# EasyEDA schematic SCH_STM32小车车V3.3.0_2023-02-14.json
TITLE: Sheet_1; REV: V3.3.0; Date: 2021-11-21; Sheet: 1/1; Drawn By: 好家伙VCC; Company: 好家伙VCC
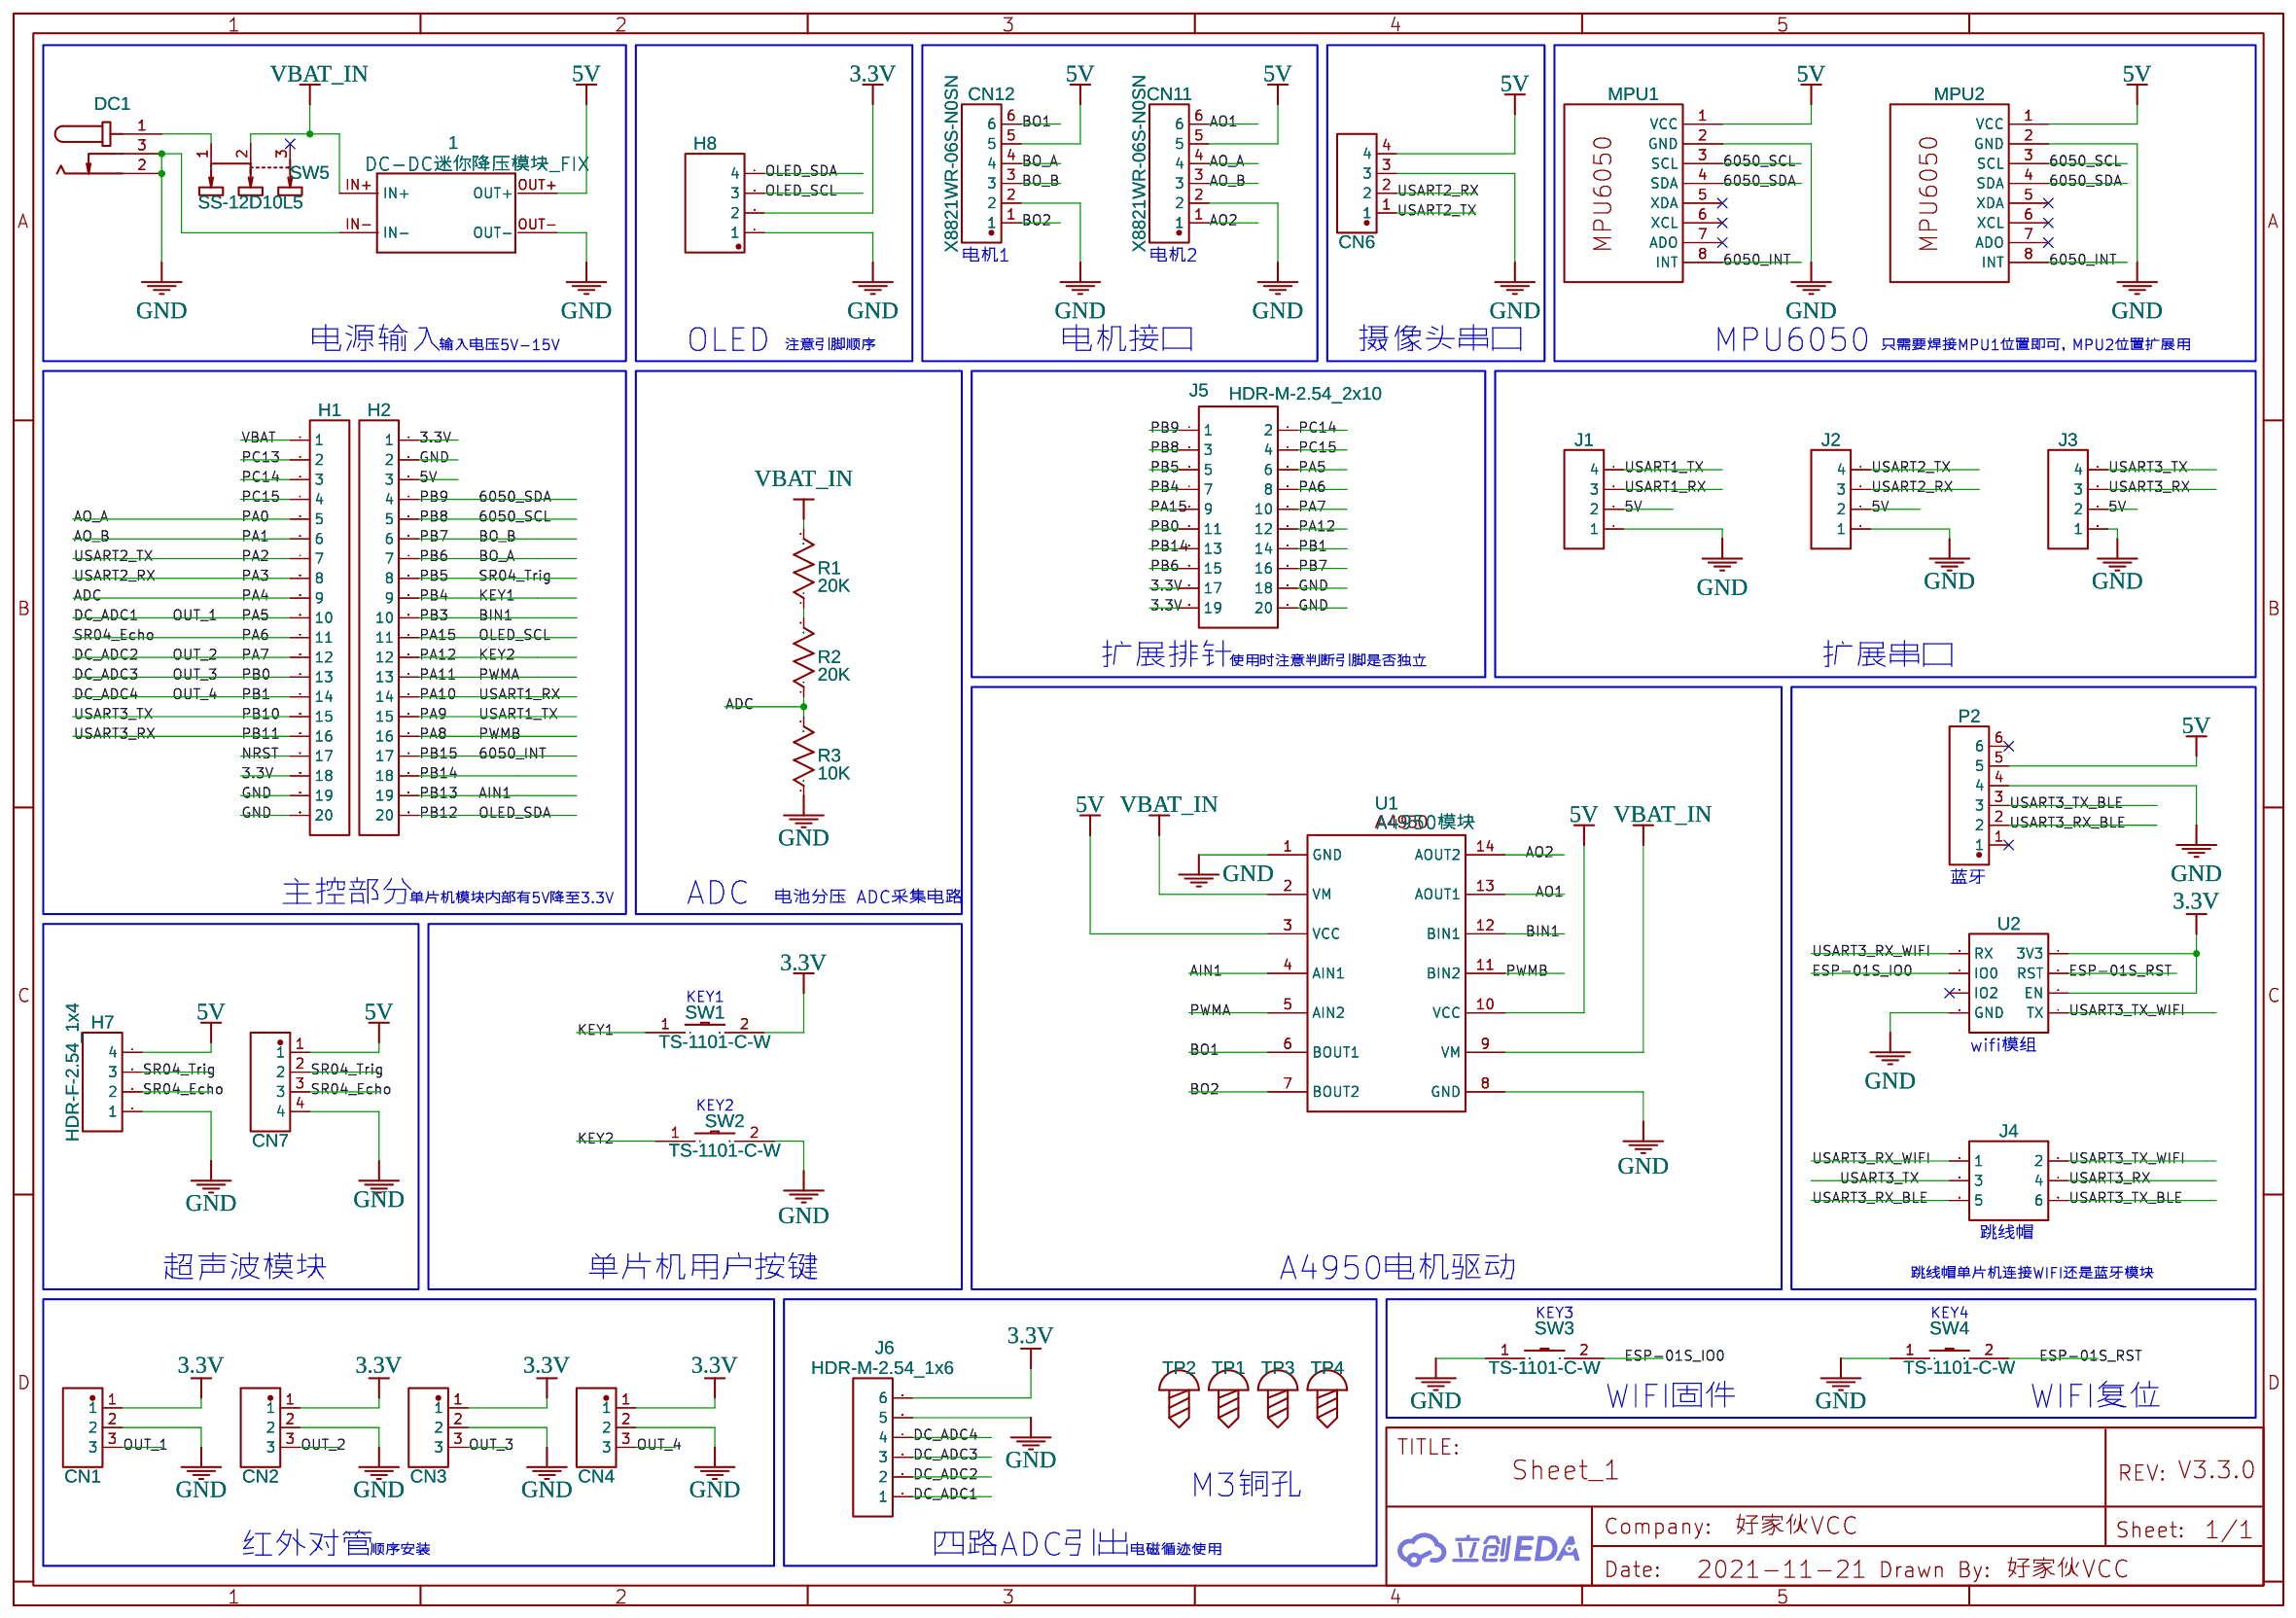
[diagram p0: schematic sheet]

## Parts
1  DC-DC迷你降压模块_FIX  [DC-DC迷你降压模块]
CN1  X8821WR-03S-N0SN  [CONN-TH_3P-P2.50_X8821WR-03S-N0SN]
CN2  X8821WR-03S-N0SN  [CONN-TH_3P-P2.50_X8821WR-03S-N0SN]
CN3  X8821WR-03S-N0SN  [CONN-TH_3P-P2.50_X8821WR-03S-N0SN]
CN4  X8821WR-03S-N0SN  [CONN-TH_3P-P2.50_X8821WR-03S-N0SN]
CN6  HX25003-4WAP  [CONN-TH_4P-P2.50_HX25003-4WAP]
CN7  HX25003-4WAP  [CONN-TH_4P-P2.50_HX25003-4WAP]
CN11  X8821WR-06S-N0SN  [CONN-TH_6P-P2.50_X8821WR-06S-N2SN]
CN12  X8821WR-06S-N0SN  [CONN-TH_6P-P2.50_X8821WR-06S-N2SN]
DC1  DC005_C431533  [DC-IN-TH_DC005]
H1  HDR-F-2.54_1x20  [HDR-F-2.54_1X20]
H2  HDR-F-2.54_1x20  [HDR-F-2.54_1X20]
H7  HDR-F-2.54_1x4  [HDR-F-2.54_1X4]
H8  Header-Male-2.54_1x4  [OLED 0.96 带铜孔]
J1  HDR-M-2.54_1x4  [HDR-M-2.54_1X4]
J2  HDR-M-2.54_1x4  [HDR-M-2.54_1X4]
J3  HDR-M-2.54_1x4  [HDR-M-2.54_1X4]
J4  Header-Male-2.54_2x3  [HDR-TH_6P-P2.54-V-M-R2-C3-S2.54-1]
J5  HDR-M-2.54_2x10  [HDR-M-2.54_2X10]
J6  HDR-M-2.54_1x6  [HDR-M-2.54_1X6]
MPU1  MPU6050 有孔(锁定丝印)  [MPU6050-丝印不可移]
MPU2  MPU6050 有孔(锁定丝印)  [MPU6050-丝印不可移]
P2  Header-Female-2.54_1x6  [HDR-TH_6P-P2.54-V-F]
R1  20K  [R0603]
R2  20K  [R0603]
R3  10K  [R0603]
SW1  TS-1101-C-W  [SW-SMD_L6.0-W3.3-LS8.0]
SW2  TS-1101-C-W  [SW-SMD_L6.0-W3.3-LS8.0]
SW3  TS-1101-C-W  [SW-SMD_L6.0-W3.3-LS8.0]
SW4  TS-1101-C-W  [SW-SMD_L6.0-W3.3-LS8.0]
SW5  SS-12D10L5  [SW-TH_SS-12D10L5]
TP1  M3铜柱带丝印  [M3铜柱]
TP2  M3铜柱带丝印  [M3铜柱]
TP3  M3铜柱带丝印  [M3铜柱]
TP4  M3铜柱带丝印  [M3铜柱]
U1  A4950模块  [A4950]
U2  ESP-01S模块  [ESP01S]

## Library data of the parts
1 = DC-DC迷你降压模块_FIX: Contributor: Satun
CN1-CN4 = X8821WR-03S-N0SN: Supplier: LCSC; Supplier Part: C388740; Manufacturer: XKB Enterprise; Contributor: LCSC; JLCPCB Part Class: Extended Part
CN6 CN7 = HX25003-4WAP: Supplier: LCSC; Supplier Part: C442328; Manufacturer: HX(Zhejiang Yueqing Hongxing Elec); Contributor: LCSC; JLCPCB Part Class: Extended Part
CN11 CN12 = X8821WR-06S-N0SN: Supplier: LCSC; Supplier Part: C388743; Manufacturer: XKB Enterprise; Contributor: LCSC; JLCPCB Part Class: Extended Part
DC1 = DC005_C431533: Supplier: LCSC; Supplier Part: C431533; Manufacturer: SHOU HAN; Manufacturer Part: DC005; Contributor: LCSC; JLCPCB Part Class: Extended Part
H1 H2 = HDR-F-2.54_1x20: Supplier Part: C50984; Supplier: LCSC; Manufacturer: BOOMELE; Manufacturer Part: 2.54mm 1*20P Female header; Contributor: LCEDA_Lib
H7 = HDR-F-2.54_1x4: Supplier Part: C225501; Supplier: LCSC; Contributor: LCEDA_Lib
H8 = Header-Male-2.54_1x4: Supplier: LCSC; Manufacturer: Changjiang Connectors; Manufacturer Part: A2541HWV-4P; Contributor: LCSC; Supplier Part: C225501; JLCPCB Part Class: Extended Part
J1-J3 = HDR-M-2.54_1x4: Supplier Part: C124378; Supplier: LCSC; Contributor: LCEDA_Lib
J4 = Header-Male-2.54_2x3: Supplier: LCSC; Manufacturer: BOOMELE; Supplier Part: C65114; JLCPCB Part Class: Extended Part
J5 = HDR-M-2.54_2x10: Supplier Part: C124359; Supplier: LCSC; Contributor: LCEDA_Lib
J6 = HDR-M-2.54_1x6: Supplier Part: C190819; Supplier: LCSC; Contributor: LCEDA_Lib
MPU1 MPU2 = MPU6050 有孔(锁定丝印): Contributor: ab_cd
P2 = Header-Female-2.54_1x6: Supplier: LCSC; Manufacturer: BOOMELE; Manufacturer Part: Female header 1*6p; Supplier Part: C40877; JLCPCB Part Class: Extended Part
R1-R3 = R_0603_US: Contributor: LCEDA_Lib
SW1-SW4 = TS-1101-C-W: Supplier: LCSC; Supplier Part: C318938; Manufacturer: XKB Connectivity(中国星坤); Contributor: LCSC; JLCPCB Part Class: Extended Part
SW5 = SS-12D10L5: Supplier: LCSC; Supplier Part: C319012; Manufacturer: XKB Enterprise; Contributor: LCSC; JLCPCB Part Class: Extended Part
TP1-TP4 = M3铜柱带丝印: Contributor: ZKMm
U1 = A4950模块: Contributor: soulyiran
U2 = ESP-01S模块: Contributor: ZKMm

## Nets
3.3V: CN1.1 CN2.1 CN3.1 CN4.1 H1.18 H2.1 H8.2 J5.17 J5.19 J6.6 SW1.2 U2.1(3V3) U2.3(EN)
5V: 1.OUT+ CN6.4 CN7.1 CN11.5 CN12.5 H2.3 H7.4 J1.2 J2.2 J3.2 MPU1.1(VCC) MPU2.1(VCC) P2.5 U1.3(VCC) U1.10(VCC)
GND: 1.IN- 1.OUT- CN1.2 CN2.2 CN3.2 CN4.2 CN6.3 CN7.4 CN11.2 CN12.2 DC1.2 DC1.3 H1.19 H1.20 H2.2 H7.1 H8.1 J1.1 J2.1 J3.1 J5.18 J5.20 J6.5 MPU1.2(GND) MPU2.2(GND) P2.4 R3.1 SW2.2 SW3.1 SW4.1 U1.1(GND) U1.8(GND) U2.5(GND)
VBAT: H1.1
VBAT_IN: 1.IN+ R1.2 SW5.2 U1.2(VM) U1.9(VM)
6050_INT: H2.17 MPU1.8(INT) MPU2.8(INT)
6050_SCL: H2.5 J5.3 MPU1.3(SCL) MPU2.3(SCL)
6050_SDA: H2.4 J5.1 MPU1.4(SDA) MPU2.4(SDA)
ADC: H1.9 R2.1 R3.2
AIN1: H2.19 U1.4(AIN1)
AO1: CN11.6 U1.13(AOUT1)
AO2: CN11.1 U1.14(AOUT2)
AO_A: CN11.4 H1.5
AO_B: CN11.3 H1.6
BIN1: H2.10 U1.12(BIN1)
BO1: CN12.6 U1.6(BOUT1)
BO2: CN12.1 U1.7(BOUT2)
BO_A: CN12.4 H2.7 J5.15
BO_B: CN12.3 H2.6 J5.16
DC_ADC1: CN1.3 H1.10 J5.6 J6.1
DC_ADC2: CN2.3 H1.12 J5.10 J6.2
DC_ADC3: CN3.3 H1.13 J5.11 J6.3
DC_ADC4: CN4.3 H1.14 J5.14 J6.4
ESP-01S_IO0: SW3.2 U2.7(IO0)
ESP-01S_RST: SW4.2 U2.2(RST)
KEY1: H2.9 J5.7 SW1.1
KEY2: H2.12 J5.12 SW2.1
NRST: H1.17
OLED_SCL: H2.11 H8.3 J5.9
OLED_SDA: H2.20 H8.4
PA2: CN6.1 H1.7 J2.4
PA3: CN6.2 H1.8 J2.3
PA6: CN7.3 H1.11 H7.2 J5.8
PA8: H2.16 U1.11(BIN2)
PA9: H2.15 J1.4
PA10: H2.14 J1.3
PA11: H2.13 U1.5(AIN2)
PB5: CN7.2 H2.8 H7.3 J5.5
PB10: H1.15 J3.4 J4.3
PB11: H1.16 J3.3 J4.4
PB14: H2.18 J5.13
PC13: H1.2
PC14: H1.3 J5.2
PC15: H1.4 J5.4
USART3_RX_BLE: J4.5 P2.2
USART3_RX_WIFI: J4.1 U2.8(RX)
USART3_TX_BLE: J4.6 P2.3
USART3_TX_WIFI: J4.2 U2.4(TX)
Net-(DC1-1): DC1.1 SW5.1
Net-(R1-1): R1.1 R2.2

Not connected (* = marked no-connect by the designer): MPU1 5(XDA)* 6(XCL)* 7(ADO)*; MPU2 5(XDA)* 6(XCL)* 7(ADO)*; P2 1* 6*; SW5 3*; U2 6(IO2)*

## Notes on the sheet
- 电机1
- 电机2
- 电源输入
- OLED
- 电机接口
- 摄像头串口
- MPU6050
- 输入电压5V-15V
- 注意引脚顺序
- 只需要焊接MPU1位置即可，MPU2位置扩展用
- 扩展排针
- 使用时注意判断引脚是否独立
- 扩展串口
- 主控部分
- ADC
- 蓝牙
- 单片机模块内部有5V降至3.3V
- 电池分压 ADC采集电路
- KEY1
- wifi模组
- KEY2
- 跳线帽
- 超声波模块
- 单片机用户按键
- A4950电机驱动
- 跳线帽单片机连接WIFI还是蓝牙模块
- KEY3
- KEY4
- WIFI固件
- WIFI复位
- M3铜孔
- 红外对管
- 四路ADC引出
- 顺序安装
- 电磁循迹使用
